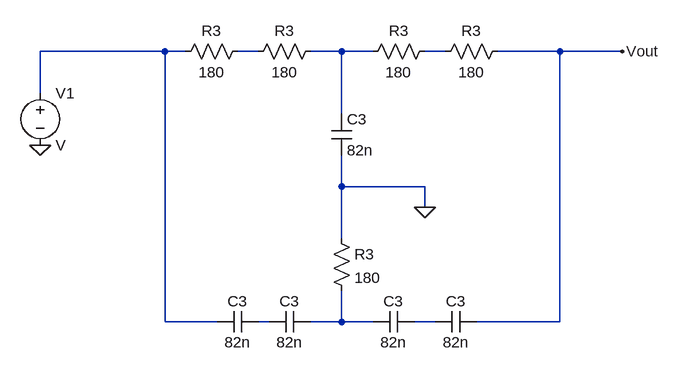
[diagram p0: schematic Diseño Placa.asc]
Diseño Placa.asc, the LTspice schematic file:
Version 4
SHEET 1 880 680
WIRE 16 -224 -176 -224
WIRE 48 -224 16 -224
WIRE 160 -224 128 -224
WIRE 288 -224 240 -224
WIRE 336 -224 288 -224
WIRE 448 -224 416 -224
WIRE 624 -224 528 -224
WIRE 720 -224 624 -224
WIRE -176 -160 -176 -224
WIRE 288 -128 288 -224
WIRE 288 -16 288 -64
WIRE 416 -16 288 -16
WIRE 416 16 416 -16
WIRE 288 64 288 -16
WIRE 16 192 16 -224
WIRE 96 192 16 192
WIRE 176 192 160 192
WIRE 288 192 288 144
WIRE 288 192 240 192
WIRE 336 192 288 192
WIRE 432 192 400 192
WIRE 624 192 624 -224
WIRE 624 192 496 192
FLAG -176 -80 0
FLAG 416 16 0
FLAG 720 -224 Vout
SYMBOL cap 160 176 R90
WINDOW 0 0 32 VBottom 2
WINDOW 3 32 32 VTop 2
SYMATTR InstName C3
SYMATTR Value 82n
SYMBOL cap 240 176 R90
WINDOW 0 0 32 VBottom 2
WINDOW 3 32 32 VTop 2
SYMATTR InstName C3
SYMATTR Value 82n
SYMBOL cap 400 176 R90
WINDOW 0 0 32 VBottom 2
WINDOW 3 32 32 VTop 2
SYMATTR InstName C3
SYMATTR Value 82n
SYMBOL cap 496 176 R90
WINDOW 0 0 32 VBottom 2
WINDOW 3 32 32 VTop 2
SYMATTR InstName C3
SYMATTR Value 82n
SYMBOL res 272 48 R0
SYMATTR InstName R3
SYMATTR Value 180
SYMBOL cap 272 -128 R0
SYMATTR InstName C3
SYMATTR Value 82n
SYMBOL res 432 -240 R90
WINDOW 0 0 56 VBottom 2
WINDOW 3 32 56 VTop 2
SYMATTR InstName R3
SYMATTR Value 180
SYMBOL res 544 -240 R90
WINDOW 0 0 56 VBottom 2
WINDOW 3 32 56 VTop 2
SYMATTR InstName R3
SYMATTR Value 180
SYMBOL res 144 -240 R90
WINDOW 0 0 56 VBottom 2
WINDOW 3 32 56 VTop 2
SYMATTR InstName R3
SYMATTR Value 180
SYMBOL res 256 -240 R90
WINDOW 0 0 56 VBottom 2
WINDOW 3 32 56 VTop 2
SYMATTR InstName R3
SYMATTR Value 180
SYMBOL voltage -176 -176 R0
SYMATTR InstName V1

The netlist it stands for:
* Diseño Placa.asc
C3 N005 N001 82n
C3 N006 N005 82n
C3 N007 N006 82n
C3 Vout N007 82n
R3 0 N006 180
C3 N003 0 82n
R3 N004 N003 180
R3 Vout N004 180
R3 N002 N001 180
R3 N003 N002 180
V1 N001 0 V
.backanno
.end